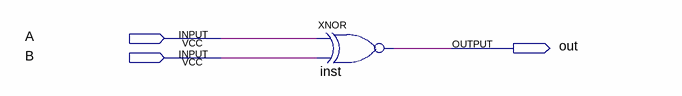
[diagram p0: schematic sheet]
// Quartus schematic IgualBit.bdf as structural Verilog: 1 symbols, 3 pins
module IgualBit (
  input  A,
  input  B,
  output out
);

  xnor inst (out, A, B);
endmodule
